# EAGLE design usb (EAGLE 5.11)
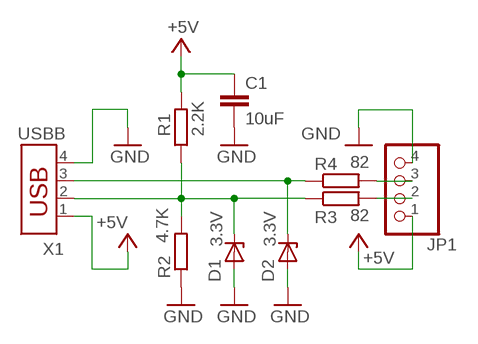
[diagram p0: schematic, sheet 1]

## Parts
C1  10uF  C-EU025-025X050  [C025-025X050]
D1  3.3V  1N4728  [DO41Z10]
D2  3.3V  1N4728  [DO41Z10]
JP1  PINHD-1X4  [1X04]
R1  2.2K  R-EU_0207/10  [0207/10]
R2  4.7K  R-EU_0207/10  [0207/10]
R3  82  R-EU_0207/10  [0207/10]
R4  82  R-EU_0207/10  [0207/10]
X1  USBB  [USB-B]

## Nets
+5V: C1.1 JP1.1 R1.2 X1.1
GND: C1.2 D1.A D2.A JP1.4 R2.1 X1.4
N$1: D1.C R1.1 R2.2 R3.1 X1.2
N$2: D2.C R4.1 X1.3
N$3: JP1.3 R4.2
N$4: JP1.2 R3.2
Unconnected: X1.S1(G1) X1.S2(G2)

## Library data of the parts
C1 = mega:C-EU: CAPACITOR, European symbol
D1 D2 = mega:1N4728: Z DIODE 3.3 V, 1W, 5 percent
JP1 = mega:PINHD-1X4: PIN HEADER
R1-R4 = mega:R-EU_: RESISTOR, European symbol
X1 = mega:USB

## Board
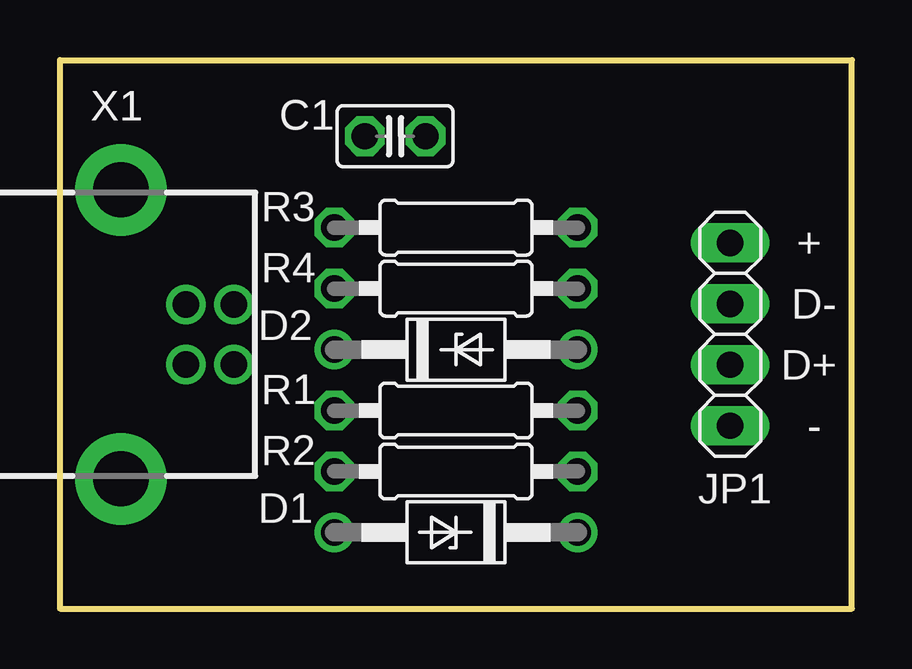
[diagram p1: board, top side]
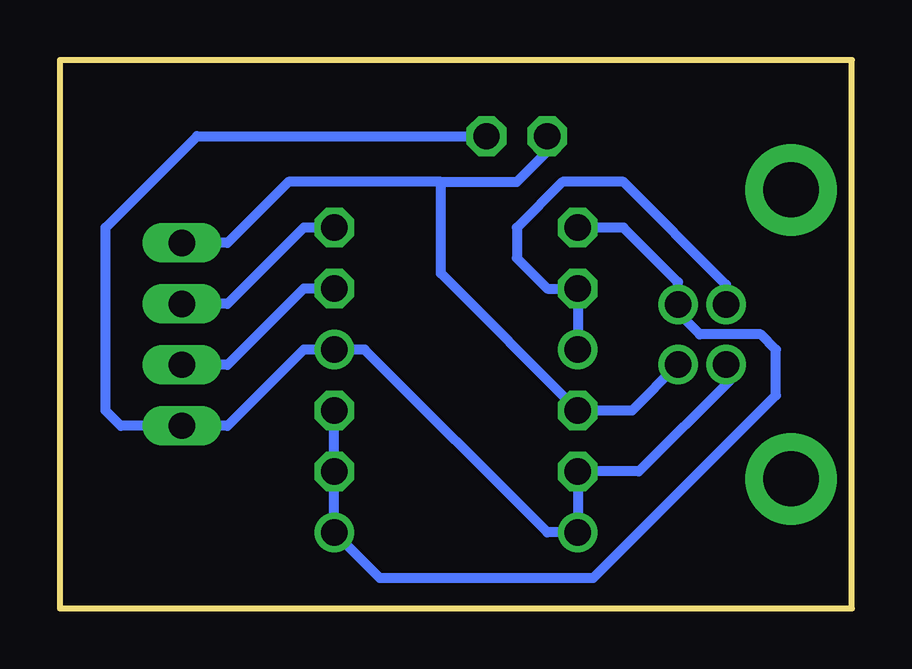
[diagram p2: board, bottom side, seen from below]

Size 33.02 x 22.86 mm. Coordinates in mm from the lower left corner, seen from the top.
Outline: 0,0 33.02,0 33.02,22.86 0,22.86 0,0
Copper layers (1*16): Top 0.035mm / dielectric 1.5mm / Bottom 0.035mm
Design rules "default": minimum track width 10mil, minimum drill 24mil, track to track 8mil, track to pad 8mil, pad to pad 8mil, via to via 8mil, smd to smd 8mil, copper to edge 40mil, drill to drill 8mil, minimum pad ring 10mil, minimum via ring 8mil, stop-mask expansion 4mil, vias tented up to drill 0mil, thermal gap 10mil

### Footprints (pad centres in the part's own frame; a part is rotated, then mirrored left to right if it is on the bottom)
C025-025X050 = drill 1.1 octagon: 1 -1.27,0; 2 1.27,0
DO41Z10 = drill 1.1 round: A 5.08,0; C -5.08,0
1X04 = drill 1.1 long: 1 -3.81,0; 2 -1.27,0; 3 1.27,0; 4 3.81,0
0207/10 = drill 1.1 octagon: 1 -5.08,0; 2 5.08,0
USB-B = drill 1.1 round: 1 1.25,4.71; 2 -1.25,4.71; 3 -1.25,2.71; 4 1.25,2.71 | drill 2.3 pad 3.81 round: S1 -6.02,0; S2 6.02,0

### Placement (x,y rotation side)
C1  13.97,19.68 0 top
D1  16.51,3.17 180 top
D2  16.51,10.79 0 top
JP1  27.94,11.43 270 top
R1  16.51,8.26 180 top
R2  16.51,5.71 0 top
R3  16.51,15.88 0 top
R4  16.51,13.34 0 top
X1  2.54,11.43 270 top

### Tracks (layer width: path | path; a pad name or v marks a point on that pad's centre or on a via)
+5V
  Bottom 0.406: X1.1 9.18,8.26 R1.2 17.14,13.97 17.14,17.78 | JP1.1 26.04,15.24 23.5,17.78 17.14,17.78 | 17.14,17.78 13.97,17.78 12.7,19.05 C1.1
GND
  Bottom 0.406: C1.2 27.3,19.68 31.11,15.88 31.11,8.26 30.48,7.62 JP1.4 26.04,7.62 22.86,10.79 D2.A 20.32,10.79 12.7,3.17 D1.A R2.1 8.89,5.71 5.08,9.53 5.08,10.16 5.23,10.16 X1.4
N$1
  Bottom 0.406: D1.C R2.2 R1.1 D1.C | R3.1 9.53,15.88 7.25,13.6 X1.2 7.27,12.7 7.62,12.7 6.35,11.43 3.81,11.43 3.17,10.79 3.17,8.89 10.79,1.27 19.68,1.27 D1.C
N$2
  Bottom 0.406: D2.C R4.1 12.7,13.34 13.97,14.61 13.97,15.88 12.06,17.78 9.53,17.78 5.25,13.51 X1.3
N$3
  Bottom 0.406: JP1.3 26.04,10.16 22.86,13.34 R4.2
N$4
  Bottom 0.406: JP1.2 26.04,12.7 22.86,15.88 R3.2

### Text on the board
tNames: + | D- | D+ | -